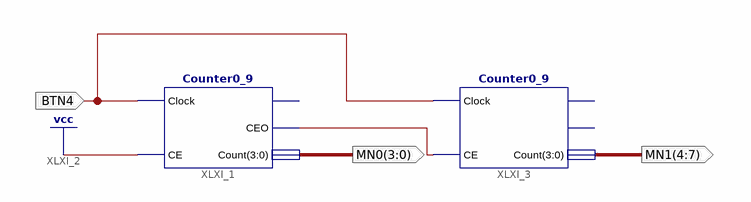
[diagram p0: schematic sheet 1]
// Xilinx ISE schematic DecadeCounter.sch (spartan6) as structural Verilog: 2 symbols, 3 ports
module DecadeCounter (
  input  BTN4,
  output [3:0] MN0,
  output [4:7] MN1
);

  wire XLXN_3;

  Counter0_9 XLXI_1 (.Clock(BTN4), .CE(1'b1), .Count(MN0), .CEO(XLXN_3));  // open: TC
  Counter0_9 XLXI_3 (.Clock(BTN4), .CE(XLXN_3), .Count(MN1));  // open: TC, CEO
endmodule
